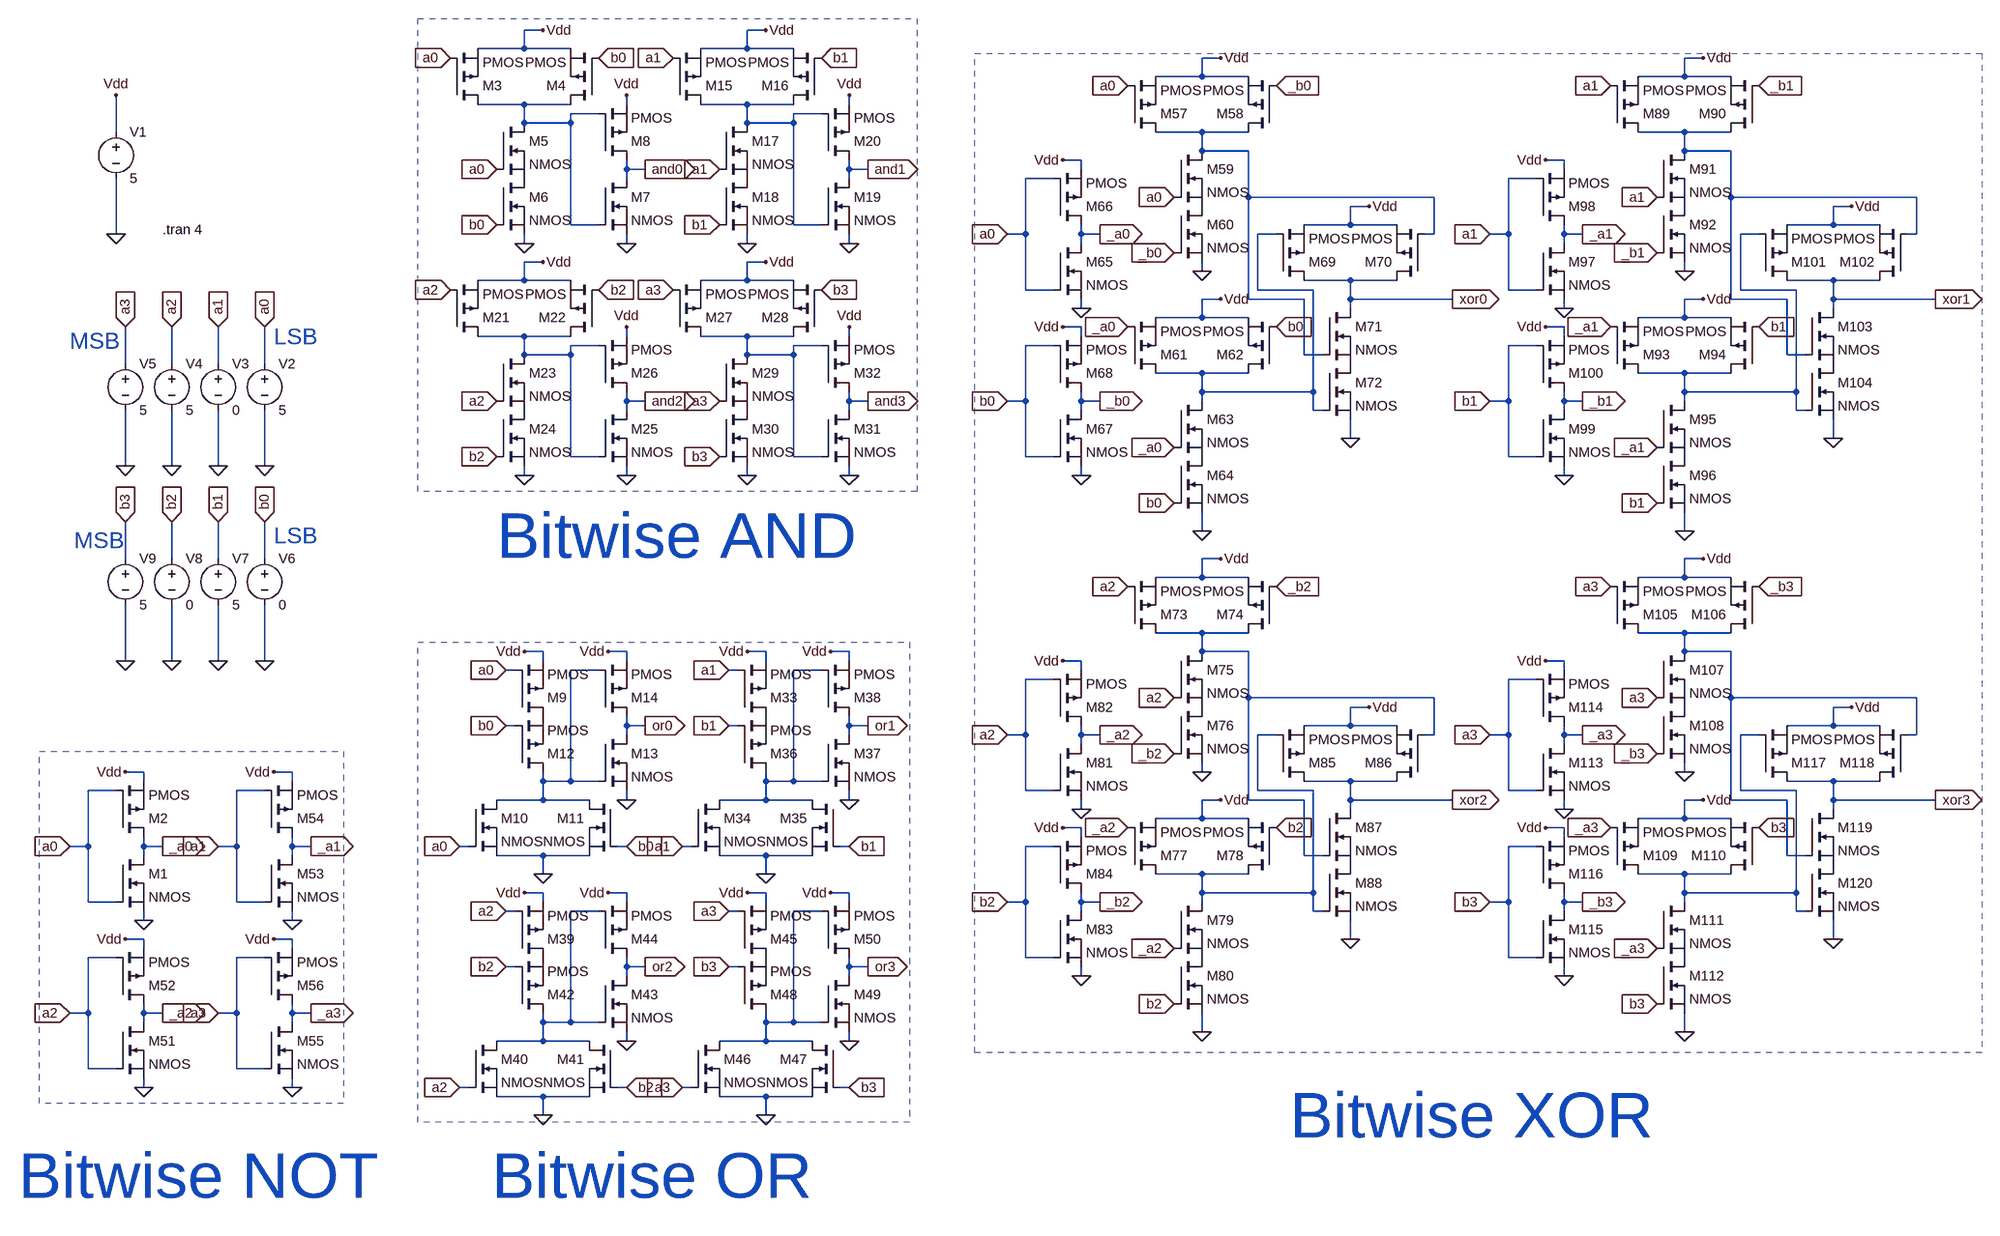
[diagram p0: schematic 4 bit Bitwise AND , OR , NOT , XOR.asc]
4 bit Bitwise AND , OR , NOT , XOR.asc, the LTspice schematic file:
Version 4
SHEET 1 3004 1392
WIRE 416 -640 384 -640
WIRE 800 -640 768 -640
WIRE 384 -608 384 -640
WIRE 384 -608 304 -608
WIRE 464 -608 384 -608
WIRE 768 -608 768 -640
WIRE 768 -608 688 -608
WIRE 848 -608 768 -608
WIRE 1584 -592 1552 -592
WIRE 2416 -592 2384 -592
WIRE 1552 -560 1552 -592
WIRE 1552 -560 1472 -560
WIRE 1632 -560 1552 -560
WIRE 2384 -560 2384 -592
WIRE 2384 -560 2304 -560
WIRE 2464 -560 2384 -560
WIRE 384 -512 304 -512
WIRE 464 -512 384 -512
WIRE 560 -512 560 -528
WIRE 768 -512 688 -512
WIRE 848 -512 768 -512
WIRE 944 -512 944 -528
WIRE 512 -496 464 -496
WIRE 896 -496 848 -496
WIRE 384 -480 384 -512
WIRE 464 -480 464 -496
WIRE 464 -480 384 -480
WIRE 768 -480 768 -512
WIRE 848 -480 848 -496
WIRE 848 -480 768 -480
WIRE -320 -464 -320 -528
WIRE 1552 -464 1472 -464
WIRE 1632 -464 1552 -464
WIRE 2384 -464 2304 -464
WIRE 2464 -464 2384 -464
WIRE 1552 -432 1552 -464
WIRE 1632 -432 1552 -432
WIRE 2384 -432 2384 -464
WIRE 2464 -432 2384 -432
WIRE 1344 -416 1312 -416
WIRE 2176 -416 2144 -416
WIRE 560 -400 560 -416
WIRE 592 -400 560 -400
WIRE 944 -400 944 -416
WIRE 976 -400 944 -400
WIRE 1344 -400 1344 -416
WIRE 2176 -400 2176 -416
WIRE 560 -384 560 -400
WIRE 944 -384 944 -400
WIRE 1296 -384 1248 -384
WIRE 2128 -384 2080 -384
WIRE 1632 -352 1632 -432
WIRE 1952 -352 1632 -352
WIRE 2464 -352 2464 -432
WIRE 2784 -352 2464 -352
WIRE 1840 -336 1808 -336
WIRE 2672 -336 2640 -336
WIRE 464 -304 464 -480
WIRE 512 -304 464 -304
WIRE 848 -304 848 -480
WIRE 896 -304 848 -304
WIRE 1808 -304 1808 -336
WIRE 1808 -304 1728 -304
WIRE 1888 -304 1808 -304
WIRE 2640 -304 2640 -336
WIRE 2640 -304 2560 -304
WIRE 2720 -304 2640 -304
WIRE -320 -288 -320 -384
WIRE 1248 -288 1248 -384
WIRE 1248 -288 1216 -288
WIRE 1344 -288 1344 -304
WIRE 1376 -288 1344 -288
WIRE 1680 -288 1648 -288
WIRE 1952 -288 1952 -352
WIRE 1952 -288 1936 -288
WIRE 2080 -288 2080 -384
WIRE 2080 -288 2048 -288
WIRE 2176 -288 2176 -304
WIRE 2208 -288 2176 -288
WIRE 2512 -288 2480 -288
WIRE 2784 -288 2784 -352
WIRE 2784 -288 2768 -288
WIRE 384 -272 384 -288
WIRE 560 -272 560 -288
WIRE 768 -272 768 -288
WIRE 944 -272 944 -288
WIRE 1344 -272 1344 -288
WIRE 2176 -272 2176 -288
WIRE 416 -240 384 -240
WIRE 800 -240 768 -240
WIRE 1552 -224 1552 -240
WIRE 2384 -224 2384 -240
WIRE 384 -208 384 -240
WIRE 384 -208 304 -208
WIRE 464 -208 384 -208
WIRE 768 -208 768 -240
WIRE 768 -208 688 -208
WIRE 848 -208 768 -208
WIRE 1808 -208 1728 -208
WIRE 1888 -208 1808 -208
WIRE 2640 -208 2560 -208
WIRE 2720 -208 2640 -208
WIRE 1248 -192 1248 -288
WIRE 1296 -192 1248 -192
WIRE 1648 -192 1648 -288
WIRE 1744 -192 1648 -192
WIRE 2080 -192 2080 -288
WIRE 2128 -192 2080 -192
WIRE 2480 -192 2480 -288
WIRE 2576 -192 2480 -192
WIRE 1584 -176 1552 -176
WIRE 1632 -176 1632 -352
WIRE 1728 -176 1632 -176
WIRE 1808 -176 1808 -208
WIRE 1984 -176 1808 -176
WIRE 2416 -176 2384 -176
WIRE 2464 -176 2464 -352
WIRE 2560 -176 2464 -176
WIRE 2640 -176 2640 -208
WIRE 2816 -176 2640 -176
WIRE 1344 -160 1344 -176
WIRE 1808 -160 1808 -176
WIRE 2176 -160 2176 -176
WIRE 2640 -160 2640 -176
WIRE 1552 -144 1552 -176
WIRE 1552 -144 1472 -144
WIRE 1632 -144 1552 -144
WIRE 2384 -144 2384 -176
WIRE 2384 -144 2304 -144
WIRE 2464 -144 2384 -144
WIRE 1344 -128 1312 -128
WIRE 2176 -128 2144 -128
WIRE 384 -112 304 -112
WIRE 464 -112 384 -112
WIRE 560 -112 560 -128
WIRE 768 -112 688 -112
WIRE 848 -112 768 -112
WIRE 944 -112 944 -128
WIRE 1344 -112 1344 -128
WIRE 2176 -112 2176 -128
WIRE 512 -96 464 -96
WIRE 896 -96 848 -96
WIRE 1296 -96 1248 -96
WIRE 2128 -96 2080 -96
WIRE 384 -80 384 -112
WIRE 464 -80 464 -96
WIRE 464 -80 384 -80
WIRE 768 -80 768 -112
WIRE 848 -80 848 -96
WIRE 848 -80 768 -80
WIRE 1728 -80 1728 -176
WIRE 1760 -80 1728 -80
WIRE 2560 -80 2560 -176
WIRE 2592 -80 2560 -80
WIRE -304 -64 -304 -128
WIRE -224 -64 -224 -128
WIRE -144 -64 -144 -128
WIRE -64 -64 -64 -128
WIRE 1552 -48 1472 -48
WIRE 1632 -48 1552 -48
WIRE 2384 -48 2304 -48
WIRE 2464 -48 2384 -48
WIRE 1552 -16 1552 -48
WIRE 1744 -16 1744 -192
WIRE 1744 -16 1552 -16
WIRE 2384 -16 2384 -48
WIRE 2576 -16 2576 -192
WIRE 2576 -16 2384 -16
WIRE 560 0 560 -16
WIRE 592 0 560 0
WIRE 944 0 944 -16
WIRE 976 0 944 0
WIRE 1248 0 1248 -96
WIRE 1248 0 1216 0
WIRE 1344 0 1344 -16
WIRE 1376 0 1344 0
WIRE 1552 0 1552 -16
WIRE 2080 0 2080 -96
WIRE 2080 0 2048 0
WIRE 2176 0 2176 -16
WIRE 2208 0 2176 0
WIRE 2384 0 2384 -16
WIRE 560 16 560 0
WIRE 944 16 944 0
WIRE 1344 16 1344 0
WIRE 1744 16 1744 -16
WIRE 1760 16 1744 16
WIRE 2176 16 2176 0
WIRE 2576 16 2576 -16
WIRE 2592 16 2576 16
WIRE 1808 64 1808 32
WIRE 2640 64 2640 32
WIRE 464 96 464 -80
WIRE 512 96 464 96
WIRE 848 96 848 -80
WIRE 896 96 848 96
WIRE 1248 96 1248 0
WIRE 1296 96 1248 96
WIRE 2080 96 2080 0
WIRE 2128 96 2080 96
WIRE -304 112 -304 16
WIRE -224 112 -224 16
WIRE -144 112 -144 16
WIRE -64 112 -64 16
WIRE 384 128 384 112
WIRE 560 128 560 112
WIRE 768 128 768 112
WIRE 944 128 944 112
WIRE 1344 128 1344 112
WIRE 2176 128 2176 112
WIRE 1552 224 1552 192
WIRE 2384 224 2384 192
WIRE -304 272 -304 208
WIRE -224 272 -224 208
WIRE -144 272 -144 208
WIRE -64 272 -64 208
WIRE 1584 272 1552 272
WIRE 2416 272 2384 272
WIRE 1552 304 1552 272
WIRE 1552 304 1472 304
WIRE 1632 304 1552 304
WIRE 2384 304 2384 272
WIRE 2384 304 2304 304
WIRE 2464 304 2384 304
WIRE 1552 400 1472 400
WIRE 1632 400 1552 400
WIRE 2384 400 2304 400
WIRE 2464 400 2384 400
WIRE 416 432 384 432
WIRE 560 432 528 432
WIRE 800 432 768 432
WIRE 944 432 912 432
WIRE 1552 432 1552 400
WIRE 1632 432 1552 432
WIRE 2384 432 2384 400
WIRE 2464 432 2384 432
WIRE -304 448 -304 352
WIRE -224 448 -224 352
WIRE -144 448 -144 352
WIRE -64 448 -64 352
WIRE 416 448 416 432
WIRE 560 448 560 432
WIRE 800 448 800 432
WIRE 944 448 944 432
WIRE 1344 448 1312 448
WIRE 2176 448 2144 448
WIRE 368 464 352 464
WIRE 512 464 464 464
WIRE 752 464 736 464
WIRE 896 464 848 464
WIRE 1344 464 1344 448
WIRE 2176 464 2176 448
WIRE 1296 480 1248 480
WIRE 2128 480 2080 480
WIRE 1632 512 1632 432
WIRE 1952 512 1632 512
WIRE 2464 512 2464 432
WIRE 2784 512 2464 512
WIRE 1840 528 1808 528
WIRE 2672 528 2640 528
WIRE 368 560 352 560
WIRE 560 560 560 544
WIRE 592 560 560 560
WIRE 752 560 736 560
WIRE 944 560 944 544
WIRE 976 560 944 560
WIRE 1808 560 1808 528
WIRE 1808 560 1728 560
WIRE 1888 560 1808 560
WIRE 2640 560 2640 528
WIRE 2640 560 2560 560
WIRE 2720 560 2640 560
WIRE 560 576 560 560
WIRE 944 576 944 560
WIRE 1248 576 1248 480
WIRE 1248 576 1216 576
WIRE 1344 576 1344 560
WIRE 1376 576 1344 576
WIRE 1680 576 1648 576
WIRE 1952 576 1952 512
WIRE 1952 576 1936 576
WIRE 2080 576 2080 480
WIRE 2080 576 2048 576
WIRE 2176 576 2176 560
WIRE 2208 576 2176 576
WIRE 2512 576 2480 576
WIRE 2784 576 2784 512
WIRE 2784 576 2768 576
WIRE 1344 592 1344 576
WIRE 2176 592 2176 576
WIRE -272 640 -304 640
WIRE -16 640 -48 640
WIRE 1552 640 1552 624
WIRE 2384 640 2384 624
WIRE -272 656 -272 640
WIRE -16 656 -16 640
WIRE 416 656 416 640
WIRE 464 656 464 464
WIRE 464 656 416 656
WIRE 512 656 464 656
WIRE 800 656 800 640
WIRE 848 656 848 464
WIRE 848 656 800 656
WIRE 896 656 848 656
WIRE 1808 656 1728 656
WIRE 1888 656 1808 656
WIRE 2640 656 2560 656
WIRE 2720 656 2640 656
WIRE -320 672 -368 672
WIRE -64 672 -112 672
WIRE 1248 672 1248 576
WIRE 1296 672 1248 672
WIRE 1648 672 1648 576
WIRE 1744 672 1648 672
WIRE 2080 672 2080 576
WIRE 2128 672 2080 672
WIRE 2480 672 2480 576
WIRE 2576 672 2480 672
WIRE 416 688 416 656
WIRE 416 688 336 688
WIRE 496 688 416 688
WIRE 560 688 560 672
WIRE 800 688 800 656
WIRE 800 688 720 688
WIRE 880 688 800 688
WIRE 944 688 944 672
WIRE 1584 688 1552 688
WIRE 1632 688 1632 512
WIRE 1728 688 1632 688
WIRE 1808 688 1808 656
WIRE 1984 688 1808 688
WIRE 2416 688 2384 688
WIRE 2464 688 2464 512
WIRE 2560 688 2464 688
WIRE 2640 688 2640 656
WIRE 2816 688 2640 688
WIRE 1344 704 1344 688
WIRE 1808 704 1808 688
WIRE 2176 704 2176 688
WIRE 2640 704 2640 688
WIRE 1552 720 1552 688
WIRE 1552 720 1472 720
WIRE 1632 720 1552 720
WIRE 2384 720 2384 688
WIRE 2384 720 2304 720
WIRE 2464 720 2384 720
WIRE 1344 736 1312 736
WIRE 2176 736 2144 736
WIRE 1344 752 1344 736
WIRE 2176 752 2176 736
WIRE -368 768 -368 672
WIRE -368 768 -400 768
WIRE -272 768 -272 752
WIRE -240 768 -272 768
WIRE -112 768 -112 672
WIRE -112 768 -144 768
WIRE -16 768 -16 752
WIRE 16 768 -16 768
WIRE 288 768 272 768
WIRE 560 768 544 768
WIRE 672 768 656 768
WIRE 944 768 928 768
WIRE 1296 768 1248 768
WIRE 2128 768 2080 768
WIRE -272 784 -272 768
WIRE -16 784 -16 768
WIRE 416 784 336 784
WIRE 496 784 416 784
WIRE 800 784 720 784
WIRE 880 784 800 784
WIRE 1728 784 1728 688
WIRE 1760 784 1728 784
WIRE 2560 784 2560 688
WIRE 2592 784 2560 784
WIRE 416 816 416 784
WIRE 800 816 800 784
WIRE 1552 816 1472 816
WIRE 1632 816 1552 816
WIRE 2384 816 2304 816
WIRE 2464 816 2384 816
WIRE 416 848 384 848
WIRE 560 848 528 848
WIRE 800 848 768 848
WIRE 944 848 912 848
WIRE 1552 848 1552 816
WIRE 1744 848 1744 672
WIRE 1744 848 1552 848
WIRE 2384 848 2384 816
WIRE 2576 848 2576 672
WIRE 2576 848 2384 848
WIRE -368 864 -368 768
WIRE -320 864 -368 864
WIRE -112 864 -112 768
WIRE -64 864 -112 864
WIRE 416 864 416 848
WIRE 560 864 560 848
WIRE 800 864 800 848
WIRE 944 864 944 848
WIRE 1248 864 1248 768
WIRE 1248 864 1216 864
WIRE 1344 864 1344 848
WIRE 1376 864 1344 864
WIRE 1552 864 1552 848
WIRE 2080 864 2080 768
WIRE 2080 864 2048 864
WIRE 2176 864 2176 848
WIRE 2208 864 2176 864
WIRE 2384 864 2384 848
WIRE 368 880 352 880
WIRE 512 880 464 880
WIRE 752 880 736 880
WIRE 896 880 848 880
WIRE 1344 880 1344 864
WIRE 1744 880 1744 848
WIRE 1760 880 1744 880
WIRE 2176 880 2176 864
WIRE 2576 880 2576 848
WIRE 2592 880 2576 880
WIRE -272 896 -272 880
WIRE -16 896 -16 880
WIRE -272 928 -304 928
WIRE -16 928 -48 928
WIRE 1808 928 1808 896
WIRE 2640 928 2640 896
WIRE -272 944 -272 928
WIRE -16 944 -16 928
WIRE -320 960 -368 960
WIRE -64 960 -112 960
WIRE 1248 960 1248 864
WIRE 1296 960 1248 960
WIRE 2080 960 2080 864
WIRE 2128 960 2080 960
WIRE 368 976 352 976
WIRE 560 976 560 960
WIRE 592 976 560 976
WIRE 752 976 736 976
WIRE 944 976 944 960
WIRE 976 976 944 976
WIRE 560 992 560 976
WIRE 944 992 944 976
WIRE 1344 992 1344 976
WIRE 2176 992 2176 976
WIRE -368 1056 -368 960
WIRE -368 1056 -400 1056
WIRE -272 1056 -272 1040
WIRE -240 1056 -272 1056
WIRE -112 1056 -112 960
WIRE -112 1056 -144 1056
WIRE -16 1056 -16 1040
WIRE 16 1056 -16 1056
WIRE -272 1072 -272 1056
WIRE -16 1072 -16 1056
WIRE 416 1072 416 1056
WIRE 464 1072 464 880
WIRE 464 1072 416 1072
WIRE 512 1072 464 1072
WIRE 800 1072 800 1056
WIRE 848 1072 848 880
WIRE 848 1072 800 1072
WIRE 896 1072 848 1072
WIRE 1552 1088 1552 1056
WIRE 2384 1088 2384 1056
WIRE 416 1104 416 1072
WIRE 416 1104 336 1104
WIRE 496 1104 416 1104
WIRE 560 1104 560 1088
WIRE 800 1104 800 1072
WIRE 800 1104 720 1104
WIRE 880 1104 800 1104
WIRE 944 1104 944 1088
WIRE -368 1152 -368 1056
WIRE -320 1152 -368 1152
WIRE -112 1152 -112 1056
WIRE -64 1152 -112 1152
WIRE -272 1184 -272 1168
WIRE -16 1184 -16 1168
WIRE 288 1184 272 1184
WIRE 560 1184 544 1184
WIRE 672 1184 656 1184
WIRE 944 1184 928 1184
WIRE 416 1200 336 1200
WIRE 496 1200 416 1200
WIRE 800 1200 720 1200
WIRE 880 1200 800 1200
WIRE 416 1232 416 1200
WIRE 800 1232 800 1200
FLAG -320 -288 0
FLAG -320 -528 Vdd
FLAG -64 112 0
FLAG -64 -128 a0
IOPIN -64 -128 In
FLAG -144 112 0
FLAG -144 -128 a1
IOPIN -144 -128 In
FLAG -224 112 0
FLAG -224 -128 a2
IOPIN -224 -128 In
FLAG -304 112 0
FLAG -304 -128 a3
IOPIN -304 -128 In
FLAG -64 448 0
FLAG -64 208 b0
IOPIN -64 208 In
FLAG -144 448 0
FLAG -144 208 b1
IOPIN -144 208 In
FLAG -224 448 0
FLAG -224 208 b2
IOPIN -224 208 In
FLAG -304 448 0
FLAG -304 208 b3
IOPIN -304 208 In
FLAG -272 896 0
FLAG -304 640 Vdd
FLAG -240 768 _a0
IOPIN -240 768 Out
FLAG -400 768 a0
IOPIN -400 768 In
FLAG 416 -640 Vdd
FLAG 384 -272 0
FLAG 336 -400 a0
IOPIN 336 -400 In
FLAG 512 -592 b0
IOPIN 512 -592 In
FLAG 256 -592 a0
IOPIN 256 -592 In
FLAG 336 -304 b0
IOPIN 336 -304 In
FLAG 560 -272 0
FLAG 560 -528 Vdd
FLAG 384 432 Vdd
FLAG 416 816 0
FLAG 560 688 0
FLAG 528 432 Vdd
FLAG 352 464 a0
IOPIN 352 464 In
FLAG 352 560 b0
IOPIN 352 560 In
FLAG 272 768 a0
IOPIN 272 768 In
FLAG 560 768 b0
IOPIN 560 768 In
FLAG 800 -640 Vdd
FLAG 768 -272 0
FLAG 720 -400 a1
IOPIN 720 -400 In
FLAG 896 -592 b1
IOPIN 896 -592 In
FLAG 640 -592 a1
IOPIN 640 -592 In
FLAG 720 -304 b1
IOPIN 720 -304 In
FLAG 944 -272 0
FLAG 944 -528 Vdd
FLAG 416 -240 Vdd
FLAG 384 128 0
FLAG 336 0 a2
IOPIN 336 0 In
FLAG 512 -192 b2
IOPIN 512 -192 In
FLAG 256 -192 a2
IOPIN 256 -192 In
FLAG 336 96 b2
IOPIN 336 96 In
FLAG 560 128 0
FLAG 560 -128 Vdd
FLAG 800 -240 Vdd
FLAG 768 128 0
FLAG 720 0 a3
IOPIN 720 0 In
FLAG 896 -192 b3
IOPIN 896 -192 In
FLAG 640 -192 a3
IOPIN 640 -192 In
FLAG 720 96 b3
IOPIN 720 96 In
FLAG 944 128 0
FLAG 944 -128 Vdd
FLAG 592 -400 and0
IOPIN 592 -400 Out
FLAG 976 -400 and1
IOPIN 976 -400 Out
FLAG 976 0 and3
IOPIN 976 0 Out
FLAG 592 0 and2
IOPIN 592 0 Out
FLAG 592 560 or0
IOPIN 592 560 Out
FLAG 768 432 Vdd
FLAG 800 816 0
FLAG 944 688 0
FLAG 912 432 Vdd
FLAG 736 464 a1
IOPIN 736 464 In
FLAG 736 560 b1
IOPIN 736 560 In
FLAG 656 768 a1
IOPIN 656 768 In
FLAG 944 768 b1
IOPIN 944 768 In
FLAG 976 560 or1
IOPIN 976 560 Out
FLAG 384 848 Vdd
FLAG 416 1232 0
FLAG 560 1104 0
FLAG 528 848 Vdd
FLAG 352 880 a2
IOPIN 352 880 In
FLAG 352 976 b2
IOPIN 352 976 In
FLAG 272 1184 a2
IOPIN 272 1184 In
FLAG 560 1184 b2
IOPIN 560 1184 In
FLAG 592 976 or2
IOPIN 592 976 Out
FLAG 768 848 Vdd
FLAG 800 1232 0
FLAG 944 1104 0
FLAG 912 848 Vdd
FLAG 736 880 a3
IOPIN 736 880 In
FLAG 736 976 b3
IOPIN 736 976 In
FLAG 656 1184 a3
IOPIN 656 1184 In
FLAG 944 1184 b3
IOPIN 944 1184 In
FLAG 976 976 or3
IOPIN 976 976 Out
FLAG -272 1184 0
FLAG -304 928 Vdd
FLAG -240 1056 _a2
IOPIN -240 1056 Out
FLAG -400 1056 a2
IOPIN -400 1056 In
FLAG -16 896 0
FLAG -48 640 Vdd
FLAG 16 768 _a1
IOPIN 16 768 Out
FLAG -144 768 a1
IOPIN -144 768 In
FLAG -16 1184 0
FLAG -48 928 Vdd
FLAG 16 1056 _a3
IOPIN 16 1056 Out
FLAG -144 1056 a3
IOPIN -144 1056 In
FLAG 1584 -592 Vdd
FLAG 1552 -224 0
FLAG 1504 -256 _b0
IOPIN 1504 -256 In
FLAG 1504 -352 a0
IOPIN 1504 -352 In
FLAG 1424 -544 a0
IOPIN 1424 -544 In
FLAG 1680 -544 _b0
IOPIN 1680 -544 In
FLAG 1584 -176 Vdd
FLAG 1552 224 0
FLAG 1504 176 b0
IOPIN 1504 176 In
FLAG 1504 80 _a0
IOPIN 1504 80 In
FLAG 1424 -128 _a0
IOPIN 1424 -128 In
FLAG 1680 -128 b0
IOPIN 1680 -128 In
FLAG 1984 -176 xor0
IOPIN 1984 -176 Out
FLAG 1344 -160 0
FLAG 1312 -416 Vdd
FLAG 1376 -288 _a0
IOPIN 1376 -288 Out
FLAG 1216 -288 a0
IOPIN 1216 -288 In
FLAG 1344 128 0
FLAG 1312 -128 Vdd
FLAG 1376 0 _b0
IOPIN 1376 0 Out
FLAG 1216 0 b0
IOPIN 1216 0 In
FLAG 1840 -336 Vdd
FLAG 1808 64 0
FLAG 1584 272 Vdd
FLAG 1552 640 0
FLAG 1504 608 _b2
IOPIN 1504 608 In
FLAG 1504 512 a2
IOPIN 1504 512 In
FLAG 1424 320 a2
IOPIN 1424 320 In
FLAG 1680 320 _b2
IOPIN 1680 320 In
FLAG 1584 688 Vdd
FLAG 1552 1088 0
FLAG 1504 1040 b2
IOPIN 1504 1040 In
FLAG 1504 944 _a2
IOPIN 1504 944 In
FLAG 1424 736 _a2
IOPIN 1424 736 In
FLAG 1680 736 b2
IOPIN 1680 736 In
FLAG 1984 688 xor2
IOPIN 1984 688 Out
FLAG 1344 704 0
FLAG 1312 448 Vdd
FLAG 1376 576 _a2
IOPIN 1376 576 Out
FLAG 1216 576 a2
IOPIN 1216 576 In
FLAG 1344 992 0
FLAG 1312 736 Vdd
FLAG 1376 864 _b2
IOPIN 1376 864 Out
FLAG 1216 864 b2
IOPIN 1216 864 In
FLAG 1840 528 Vdd
FLAG 1808 928 0
FLAG 2416 -592 Vdd
FLAG 2384 -224 0
FLAG 2336 -256 _b1
IOPIN 2336 -256 In
FLAG 2336 -352 a1
IOPIN 2336 -352 In
FLAG 2256 -544 a1
IOPIN 2256 -544 In
FLAG 2512 -544 _b1
IOPIN 2512 -544 In
FLAG 2416 -176 Vdd
FLAG 2384 224 0
FLAG 2336 176 b1
IOPIN 2336 176 In
FLAG 2336 80 _a1
IOPIN 2336 80 In
FLAG 2256 -128 _a1
IOPIN 2256 -128 In
FLAG 2512 -128 b1
IOPIN 2512 -128 In
FLAG 2816 -176 xor1
IOPIN 2816 -176 Out
FLAG 2176 -160 0
FLAG 2144 -416 Vdd
FLAG 2208 -288 _a1
IOPIN 2208 -288 Out
FLAG 2048 -288 a1
IOPIN 2048 -288 In
FLAG 2176 128 0
FLAG 2144 -128 Vdd
FLAG 2208 0 _b1
IOPIN 2208 0 Out
FLAG 2048 0 b1
IOPIN 2048 0 In
FLAG 2672 -336 Vdd
FLAG 2640 64 0
FLAG 2416 272 Vdd
FLAG 2384 640 0
FLAG 2336 608 _b3
IOPIN 2336 608 In
FLAG 2336 512 a3
IOPIN 2336 512 In
FLAG 2256 320 a3
IOPIN 2256 320 In
FLAG 2512 320 _b3
IOPIN 2512 320 In
FLAG 2416 688 Vdd
FLAG 2384 1088 0
FLAG 2336 1040 b3
IOPIN 2336 1040 In
FLAG 2336 944 _a3
IOPIN 2336 944 In
FLAG 2256 736 _a3
IOPIN 2256 736 In
FLAG 2512 736 b3
IOPIN 2512 736 In
FLAG 2816 688 xor3
IOPIN 2816 688 Out
FLAG 2176 704 0
FLAG 2144 448 Vdd
FLAG 2208 576 _a3
IOPIN 2208 576 Out
FLAG 2048 576 a3
IOPIN 2048 576 In
FLAG 2176 992 0
FLAG 2144 736 Vdd
FLAG 2208 864 _b3
IOPIN 2208 864 Out
FLAG 2048 864 b3
IOPIN 2048 864 In
FLAG 2672 528 Vdd
FLAG 2640 928 0
SYMBOL voltage -320 -480 R0
SYMATTR InstName V1
SYMATTR Value 5
SYMBOL voltage -64 -80 R0
SYMATTR InstName V2
SYMATTR Value 5
SYMBOL voltage -144 -80 R0
SYMATTR InstName V3
SYMATTR Value 0
SYMBOL voltage -224 -80 R0
SYMATTR InstName V4
SYMATTR Value 5
SYMBOL voltage -304 -80 R0
SYMATTR InstName V5
SYMATTR Value 5
SYMBOL voltage -64 256 R0
SYMATTR InstName V6
SYMATTR Value 0
SYMBOL voltage -144 256 R0
SYMATTR InstName V7
SYMATTR Value 5
SYMBOL voltage -224 256 R0
SYMATTR InstName V8
SYMATTR Value 0
SYMBOL voltage -304 256 R0
SYMATTR InstName V9
SYMATTR Value 5
SYMBOL nmos -320 784 R0
SYMATTR InstName M1
SYMBOL pmos -320 752 M180
SYMATTR InstName M2
SYMBOL pmos 256 -512 M180
SYMATTR InstName M3
SYMBOL pmos 512 -512 R180
SYMATTR InstName M4
SYMBOL nmos 336 -480 R0
SYMATTR InstName M5
SYMBOL nmos 336 -384 R0
SYMATTR InstName M6
SYMBOL nmos 512 -384 R0
SYMATTR InstName M7
SYMBOL pmos 512 -416 M180
SYMATTR InstName M8
SYMBOL pmos 368 544 M180
SYMATTR InstName M9
SYMBOL nmos 288 688 R0
SYMATTR InstName M10
SYMBOL nmos 544 688 M0
SYMATTR InstName M11
SYMBOL pmos 368 640 M180
SYMATTR InstName M12
SYMBOL nmos 512 576 R0
SYMATTR InstName M13
SYMBOL pmos 512 544 M180
SYMATTR InstName M14
SYMBOL pmos 640 -512 M180
SYMATTR InstName M15
SYMBOL pmos 896 -512 R180
SYMATTR InstName M16
SYMBOL nmos 720 -480 R0
SYMATTR InstName M17
SYMBOL nmos 720 -384 R0
SYMATTR InstName M18
SYMBOL nmos 896 -384 R0
SYMATTR InstName M19
SYMBOL pmos 896 -416 M180
SYMATTR InstName M20
SYMBOL pmos 256 -112 M180
SYMATTR InstName M21
SYMBOL pmos 512 -112 R180
SYMATTR InstName M22
SYMBOL nmos 336 -80 R0
SYMATTR InstName M23
SYMBOL nmos 336 16 R0
SYMATTR InstName M24
SYMBOL nmos 512 16 R0
SYMATTR InstName M25
SYMBOL pmos 512 -16 M180
SYMATTR InstName M26
SYMBOL pmos 640 -112 M180
SYMATTR InstName M27
SYMBOL pmos 896 -112 R180
SYMATTR InstName M28
SYMBOL nmos 720 -80 R0
SYMATTR InstName M29
SYMBOL nmos 720 16 R0
SYMATTR InstName M30
SYMBOL nmos 896 16 R0
SYMATTR InstName M31
SYMBOL pmos 896 -16 M180
SYMATTR InstName M32
SYMBOL pmos 752 544 M180
SYMATTR InstName M33
SYMBOL nmos 672 688 R0
SYMATTR InstName M34
SYMBOL nmos 928 688 M0
SYMATTR InstName M35
SYMBOL pmos 752 640 M180
SYMATTR InstName M36
SYMBOL nmos 896 576 R0
SYMATTR InstName M37
SYMBOL pmos 896 544 M180
SYMATTR InstName M38
SYMBOL pmos 368 960 M180
SYMATTR InstName M39
SYMBOL nmos 288 1104 R0
SYMATTR InstName M40
SYMBOL nmos 544 1104 M0
SYMATTR InstName M41
SYMBOL pmos 368 1056 M180
SYMATTR InstName M42
SYMBOL nmos 512 992 R0
SYMATTR InstName M43
SYMBOL pmos 512 960 M180
SYMATTR InstName M44
SYMBOL pmos 752 960 M180
SYMATTR InstName M45
SYMBOL nmos 672 1104 R0
SYMATTR InstName M46
SYMBOL nmos 928 1104 M0
SYMATTR InstName M47
SYMBOL pmos 752 1056 M180
SYMATTR InstName M48
SYMBOL nmos 896 992 R0
SYMATTR InstName M49
SYMBOL pmos 896 960 M180
SYMATTR InstName M50
SYMBOL nmos -320 1072 R0
SYMATTR InstName M51
SYMBOL pmos -320 1040 M180
SYMATTR InstName M52
SYMBOL nmos -64 784 R0
SYMATTR InstName M53
SYMBOL pmos -64 752 M180
SYMATTR InstName M54
SYMBOL nmos -64 1072 R0
SYMATTR InstName M55
SYMBOL pmos -64 1040 M180
SYMATTR InstName M56
SYMBOL pmos 1424 -464 M180
SYMATTR InstName M57
SYMBOL pmos 1680 -464 R180
SYMATTR InstName M58
SYMBOL nmos 1504 -432 R0
SYMATTR InstName M59
SYMBOL nmos 1504 -336 R0
SYMATTR InstName M60
SYMBOL pmos 1424 -48 M180
SYMATTR InstName M61
SYMBOL pmos 1680 -48 R180
SYMATTR InstName M62
SYMBOL nmos 1504 0 R0
SYMATTR InstName M63
SYMBOL nmos 1504 96 R0
SYMATTR InstName M64
SYMBOL nmos 1296 -272 R0
SYMATTR InstName M65
SYMBOL pmos 1296 -304 M180
SYMATTR InstName M66
SYMBOL nmos 1296 16 R0
SYMATTR InstName M67
SYMBOL pmos 1296 -16 M180
SYMATTR InstName M68
SYMBOL pmos 1680 -208 M180
SYMATTR InstName M69
SYMBOL pmos 1936 -208 R180
SYMATTR InstName M70
SYMBOL nmos 1760 -160 R0
SYMATTR InstName M71
SYMBOL nmos 1760 -64 R0
SYMATTR InstName M72
SYMBOL pmos 1424 400 M180
SYMATTR InstName M73
SYMBOL pmos 1680 400 R180
SYMATTR InstName M74
SYMBOL nmos 1504 432 R0
SYMATTR InstName M75
SYMBOL nmos 1504 528 R0
SYMATTR InstName M76
SYMBOL pmos 1424 816 M180
SYMATTR InstName M77
SYMBOL pmos 1680 816 R180
SYMATTR InstName M78
SYMBOL nmos 1504 864 R0
SYMATTR InstName M79
SYMBOL nmos 1504 960 R0
SYMATTR InstName M80
SYMBOL nmos 1296 592 R0
SYMATTR InstName M81
SYMBOL pmos 1296 560 M180
SYMATTR InstName M82
SYMBOL nmos 1296 880 R0
SYMATTR InstName M83
SYMBOL pmos 1296 848 M180
SYMATTR InstName M84
SYMBOL pmos 1680 656 M180
SYMATTR InstName M85
SYMBOL pmos 1936 656 R180
SYMATTR InstName M86
SYMBOL nmos 1760 704 R0
SYMATTR InstName M87
SYMBOL nmos 1760 800 R0
SYMATTR InstName M88
SYMBOL pmos 2256 -464 M180
SYMATTR InstName M89
SYMBOL pmos 2512 -464 R180
SYMATTR InstName M90
SYMBOL nmos 2336 -432 R0
SYMATTR InstName M91
SYMBOL nmos 2336 -336 R0
SYMATTR InstName M92
SYMBOL pmos 2256 -48 M180
SYMATTR InstName M93
SYMBOL pmos 2512 -48 R180
SYMATTR InstName M94
SYMBOL nmos 2336 0 R0
SYMATTR InstName M95
SYMBOL nmos 2336 96 R0
SYMATTR InstName M96
SYMBOL nmos 2128 -272 R0
SYMATTR InstName M97
SYMBOL pmos 2128 -304 M180
SYMATTR InstName M98
SYMBOL nmos 2128 16 R0
SYMATTR InstName M99
SYMBOL pmos 2128 -16 M180
SYMATTR InstName M100
SYMBOL pmos 2512 -208 M180
SYMATTR InstName M101
SYMBOL pmos 2768 -208 R180
SYMATTR InstName M102
SYMBOL nmos 2592 -160 R0
SYMATTR InstName M103
SYMBOL nmos 2592 -64 R0
SYMATTR InstName M104
SYMBOL pmos 2256 400 M180
SYMATTR InstName M105
SYMBOL pmos 2512 400 R180
SYMATTR InstName M106
SYMBOL nmos 2336 432 R0
SYMATTR InstName M107
SYMBOL nmos 2336 528 R0
SYMATTR InstName M108
SYMBOL pmos 2256 816 M180
SYMATTR InstName M109
SYMBOL pmos 2512 816 R180
SYMATTR InstName M110
SYMBOL nmos 2336 864 R0
SYMATTR InstName M111
SYMBOL nmos 2336 960 R0
SYMATTR InstName M112
SYMBOL nmos 2128 592 R0
SYMATTR InstName M113
SYMBOL pmos 2128 560 M180
SYMATTR InstName M114
SYMBOL nmos 2128 880 R0
SYMATTR InstName M115
SYMBOL pmos 2128 848 M180
SYMATTR InstName M116
SYMBOL pmos 2512 656 M180
SYMATTR InstName M117
SYMBOL pmos 2768 656 R180
SYMATTR InstName M118
SYMBOL nmos 2592 704 R0
SYMATTR InstName M119
SYMBOL nmos 2592 800 R0
SYMATTR InstName M120
TEXT -240 -296 Left 2 !.tran 4
TEXT -48 -112 Left 4 ;LSB
TEXT -400 -104 Left 4 ;MSB
TEXT -48 232 Left 4 ;LSB
TEXT -392 240 Left 4 ;MSB
TEXT 336 232 Left 7 ;Bitwise AND
TEXT 328 1336 Left 7 ;Bitwise OR
TEXT -488 1336 Left 7 ;Bitwise NOT
TEXT 1704 1232 Left 7 ;Bitwise XOR
RECTANGLE Normal 1060 156 200 -660 2
RECTANGLE Normal 1048 1244 200 416 2
RECTANGLE Normal 72 1212 -452 604 2
RECTANGLE Normal 2896 1124 1160 -600 2

The netlist it stands for:
* 4 bit Bitwise AND , OR , NOT , XOR.asc
V1 Vdd 0 5
V2 a0 0 5
V3 a1 0 0
V4 a2 0 5
V5 a3 0 5
V6 b0 0 0
V7 b1 0 5
V8 b2 0 0
V9 b3 0 5
M1 _a0 a0 0 0 NMOS
M2 _a0 a0 Vdd Vdd PMOS
M3 N001 a0 Vdd Vdd PMOS
M4 N001 b0 Vdd Vdd PMOS
M5 N001 a0 P001 P001 NMOS
M6 P001 b0 0 0 NMOS
M7 and0 N001 0 0 NMOS
M8 and0 N001 Vdd Vdd PMOS
M9 P002 a0 Vdd Vdd PMOS
M10 N011 a0 0 0 NMOS
M11 N011 b0 0 0 NMOS
M12 N011 b0 P002 P002 PMOS
M13 or0 N011 0 0 NMOS
M14 or0 N011 Vdd Vdd PMOS
M15 N002 a1 Vdd Vdd PMOS
M16 N002 b1 Vdd Vdd PMOS
M17 N002 a1 P003 P003 NMOS
M18 P003 b1 0 0 NMOS
M19 and1 N002 0 0 NMOS
M20 and1 N002 Vdd Vdd PMOS
M21 N007 a2 Vdd Vdd PMOS
M22 N007 b2 Vdd Vdd PMOS
M23 N007 a2 P004 P004 NMOS
M24 P004 b2 0 0 NMOS
M25 and2 N007 0 0 NMOS
M26 and2 N007 Vdd Vdd PMOS
M27 N008 a3 Vdd Vdd PMOS
M28 N008 b3 Vdd Vdd PMOS
M29 N008 a3 P005 P005 NMOS
M30 P005 b3 0 0 NMOS
M31 and3 N008 0 0 NMOS
M32 and3 N008 Vdd Vdd PMOS
M33 P006 a1 Vdd Vdd PMOS
M34 N012 a1 0 0 NMOS
M35 N012 b1 0 0 NMOS
M36 N012 b1 P006 P006 PMOS
M37 or1 N012 0 0 NMOS
M38 or1 N012 Vdd Vdd PMOS
M39 P007 a2 Vdd Vdd PMOS
M40 N015 a2 0 0 NMOS
M41 N015 b2 0 0 NMOS
M42 N015 b2 P007 P007 PMOS
M43 or2 N015 0 0 NMOS
M44 or2 N015 Vdd Vdd PMOS
M45 P008 a3 Vdd Vdd PMOS
M46 N016 a3 0 0 NMOS
M47 N016 b3 0 0 NMOS
M48 N016 b3 P008 P008 PMOS
M49 or3 N016 0 0 NMOS
M50 or3 N016 Vdd Vdd PMOS
M51 _a2 a2 0 0 NMOS
M52 _a2 a2 Vdd Vdd PMOS
M53 _a1 a1 0 0 NMOS
M54 _a1 a1 Vdd Vdd PMOS
M55 _a3 a3 0 0 NMOS
M56 _a3 a3 Vdd Vdd PMOS
M57 N003 a0 Vdd Vdd PMOS
M58 N003 _b0 Vdd Vdd PMOS
M59 N003 a0 P009 P009 NMOS
M60 P009 _b0 0 0 NMOS
M61 N005 _a0 Vdd Vdd PMOS
M62 N005 b0 Vdd Vdd PMOS
M63 N005 _a0 P010 P010 NMOS
M64 P010 b0 0 0 NMOS
M65 _a0 a0 0 0 NMOS
M66 _a0 a0 Vdd Vdd PMOS
M67 _b0 b0 0 0 NMOS
M68 _b0 b0 Vdd Vdd PMOS
M69 xor0 N005 Vdd Vdd PMOS
M70 xor0 N003 Vdd Vdd PMOS
M71 xor0 N003 P011 P011 NMOS
M72 P011 N005 0 0 NMOS
M73 N009 a2 Vdd Vdd PMOS
M74 N009 _b2 Vdd Vdd PMOS
M75 N009 a2 P012 P012 NMOS
M76 P012 _b2 0 0 NMOS
M77 N013 _a2 Vdd Vdd PMOS
M78 N013 b2 Vdd Vdd PMOS
M79 N013 _a2 P013 P013 NMOS
M80 P013 b2 0 0 NMOS
M81 _a2 a2 0 0 NMOS
M82 _a2 a2 Vdd Vdd PMOS
M83 _b2 b2 0 0 NMOS
M84 _b2 b2 Vdd Vdd PMOS
M85 xor2 N013 Vdd Vdd PMOS
M86 xor2 N009 Vdd Vdd PMOS
M87 xor2 N009 P014 P014 NMOS
M88 P014 N013 0 0 NMOS
M89 N004 a1 Vdd Vdd PMOS
M90 N004 _b1 Vdd Vdd PMOS
M91 N004 a1 P015 P015 NMOS
M92 P015 _b1 0 0 NMOS
M93 N006 _a1 Vdd Vdd PMOS
M94 N006 b1 Vdd Vdd PMOS
M95 N006 _a1 P016 P016 NMOS
M96 P016 b1 0 0 NMOS
M97 _a1 a1 0 0 NMOS
M98 _a1 a1 Vdd Vdd PMOS
M99 _b1 b1 0 0 NMOS
M100 _b1 b1 Vdd Vdd PMOS
M101 xor1 N006 Vdd Vdd PMOS
M102 xor1 N004 Vdd Vdd PMOS
M103 xor1 N004 P017 P017 NMOS
M104 P017 N006 0 0 NMOS
M105 N010 a3 Vdd Vdd PMOS
M106 N010 _b3 Vdd Vdd PMOS
M107 N010 a3 P018 P018 NMOS
M108 P018 _b3 0 0 NMOS
M109 N014 _a3 Vdd Vdd PMOS
M110 N014 b3 Vdd Vdd PMOS
M111 N014 _a3 P019 P019 NMOS
M112 P019 b3 0 0 NMOS
M113 _a3 a3 0 0 NMOS
M114 _a3 a3 Vdd Vdd PMOS
M115 _b3 b3 0 0 NMOS
M116 _b3 b3 Vdd Vdd PMOS
M117 xor3 N014 Vdd Vdd PMOS
M118 xor3 N010 Vdd Vdd PMOS
M119 xor3 N010 P020 P020 NMOS
M120 P020 N014 0 0 NMOS
.model NMOS NMOS
.model PMOS PMOS
.lib standard.mos
.tran 4
* LSB
* MSB
* LSB
* MSB
* Bitwise AND
* Bitwise OR
* Bitwise NOT
* Bitwise XOR
.backanno
.end